# EAGLE design eCog121_DHT_Temperature (EAGLE 6.6.0)
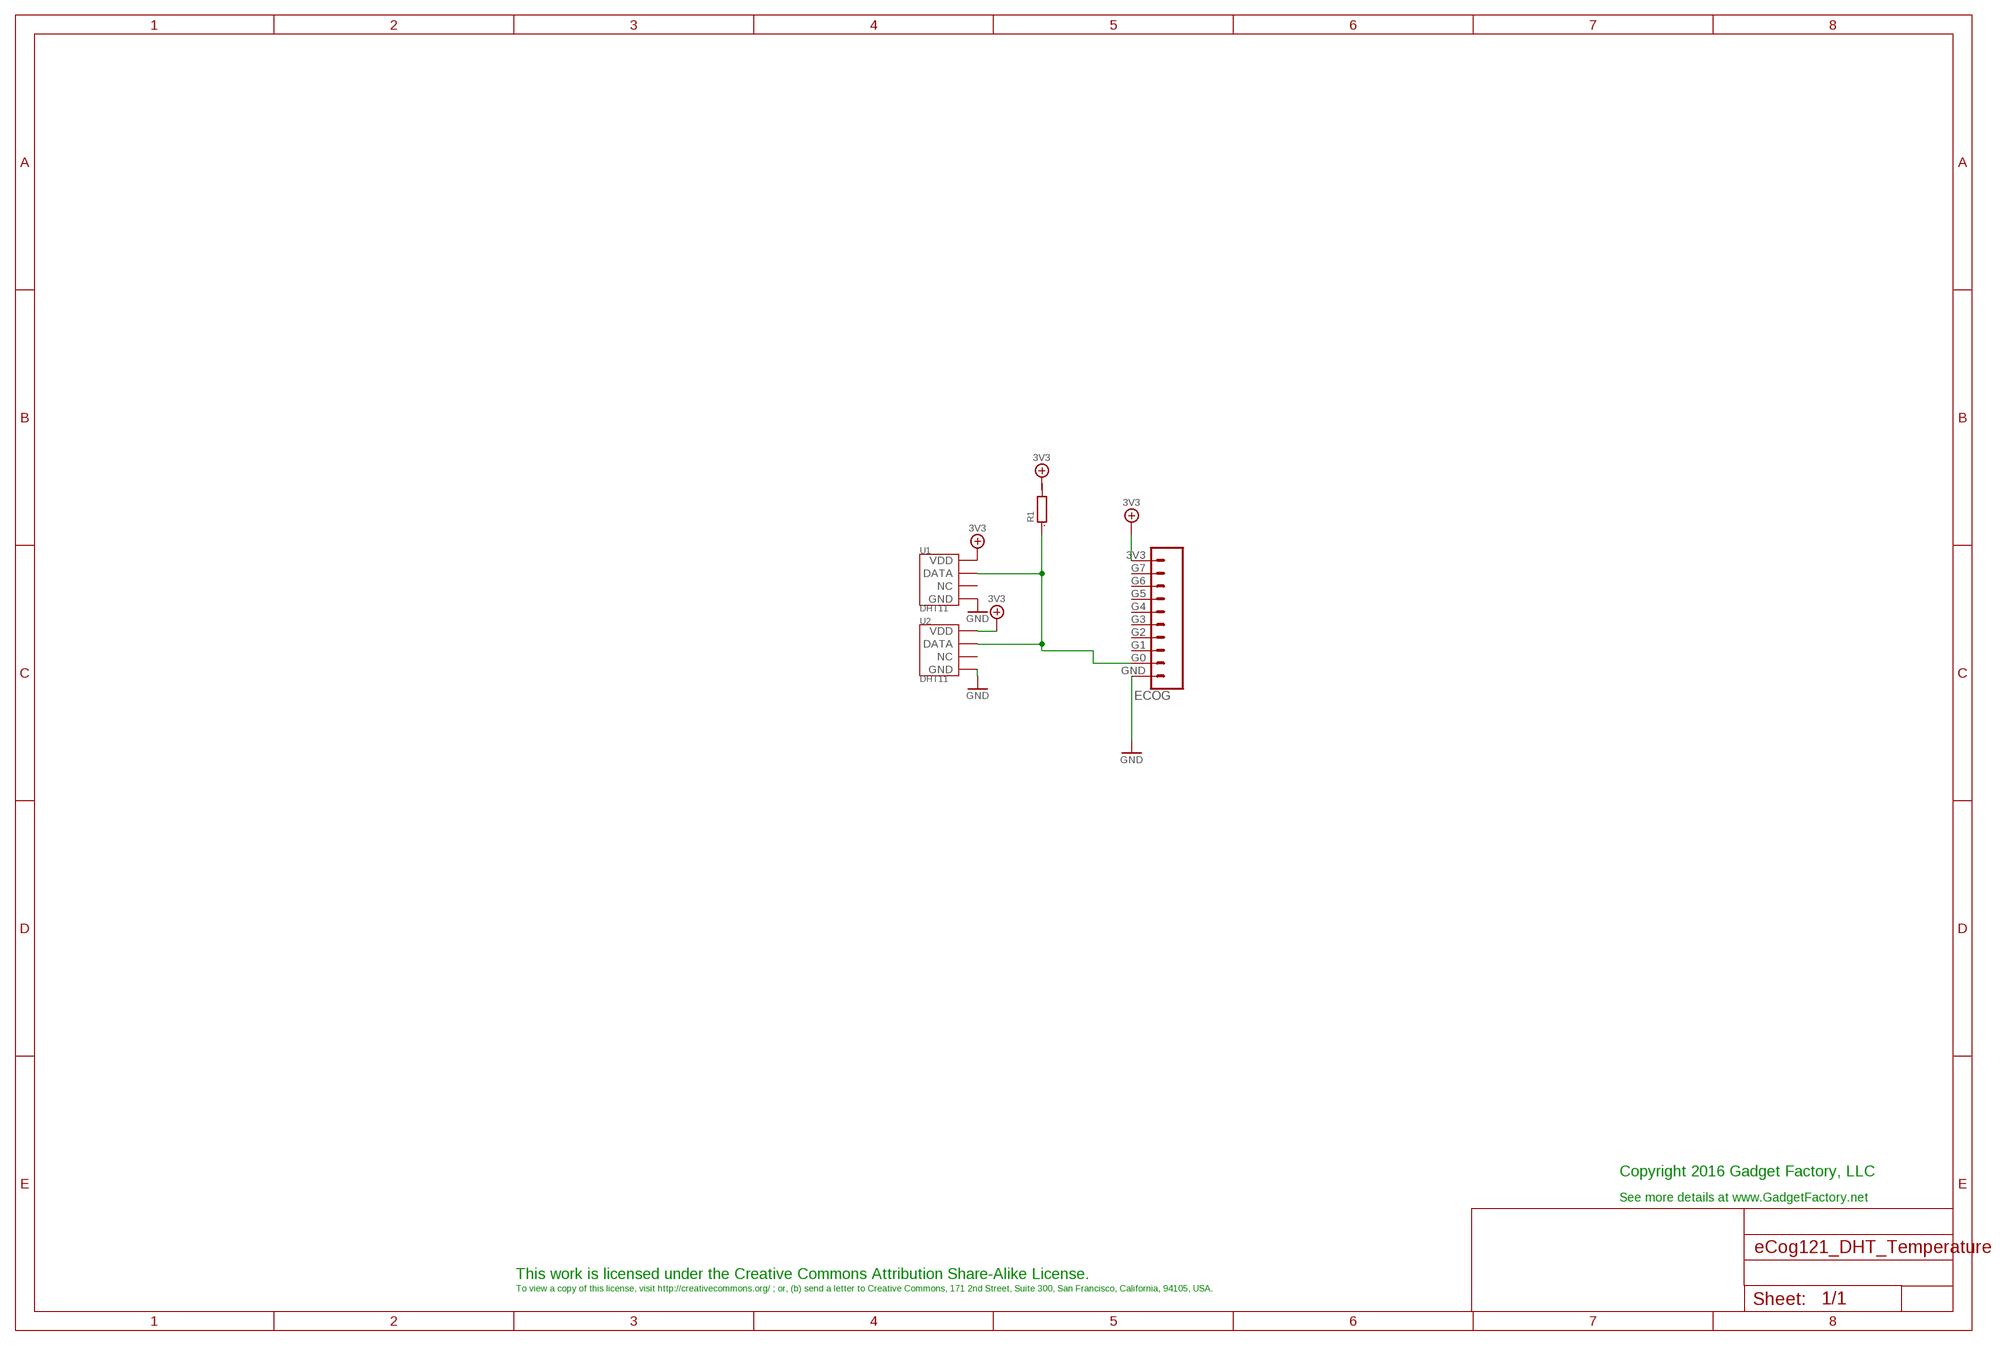
[diagram p0: schematic, sheet 1]

## Parts
ECOG  ECOG_GENERAL_ROWTHROUGHOLE  [ECOG_GENERAL_TH]
R1  R0805  [0805]
U1  DHT11  TEM-HUM-DHT11(4P-15.5X12.0MM)  [SNR4-2.54-15.5X12.0X5.5MM]
U2  DHT11  TEM-HUM-DHT11(4P-15.5X12.0MM)  [SNR4-2.54-15.5X12.0X5.5MM]

## Nets
3V3: ECOG.3V3 U1.1(VDD)
GND: ECOG.GND U1.4(GND) U2.4(GND)
N$1: ECOG.G0 R1.1 U1.2(DATA) U2.2(DATA)
VDD: U2.1(VDD) ; supply symbol labelled 3V3
Unconnected: ECOG.G1 ECOG.G2 ECOG.G3 ECOG.G4 ECOG.G5 ECOG.G6 ECOG.G7 R1.2 U1.3(NC) U2.3(NC)

## Notes on the sheet
- Copyright 2016 Gadget Factory, LLC
- See more details at www.GadgetFactory.net
- This work is licensed under the Creative Commons Attribution Share-Alike License.
- To view a copy of this license, visit http://creativecommons.org/ ; or, (b) send a letter to Creative Commons, 171 2nd Street, Suite 300, San Francisco, California, 94105, USA.

## Library data of the parts
ECOG = eCogs:ECOG_GENERAL_ROW
R1 = GadgetFactory:R: RESISTOR, European symbol
U1 U2 = Seeed-OPL-sensor:TEM-HUM-DHT11(4P-15.5X12.0MM): 314010000; MPN: DHT11

## Board
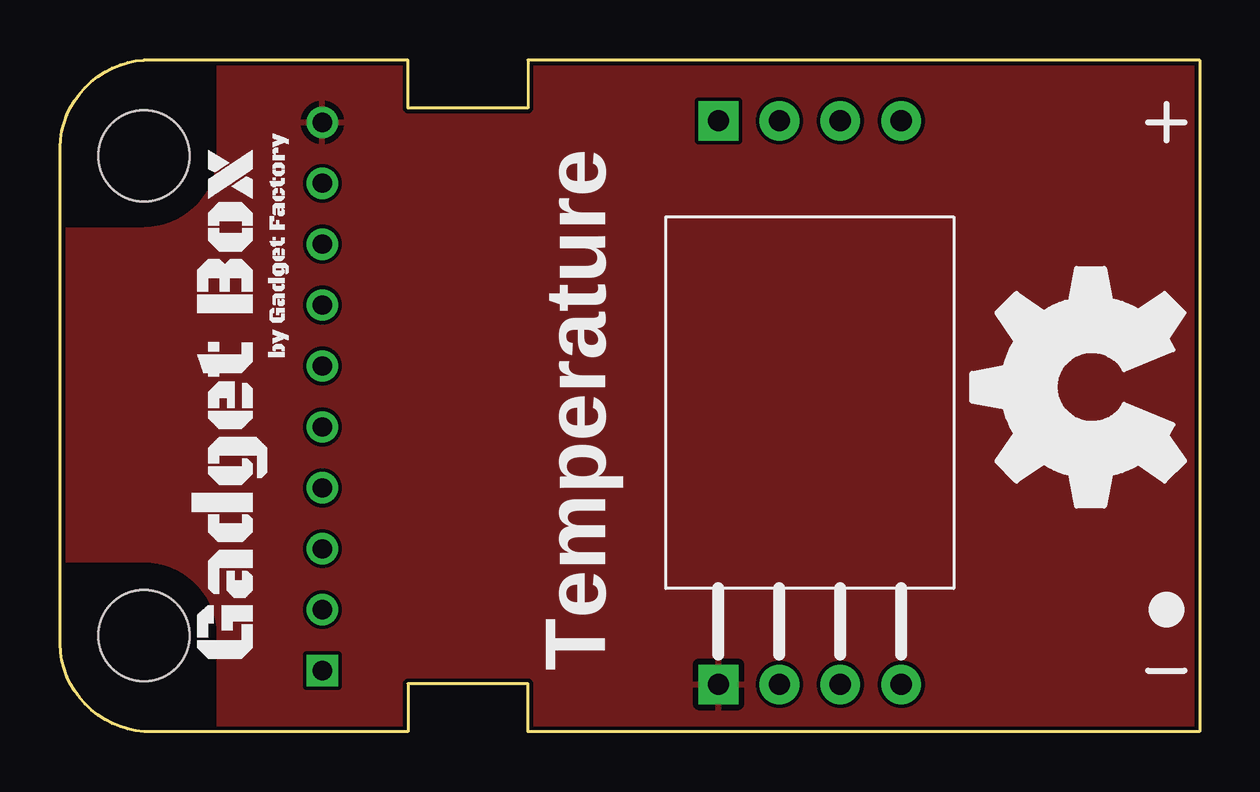
[diagram p1: board, top side]
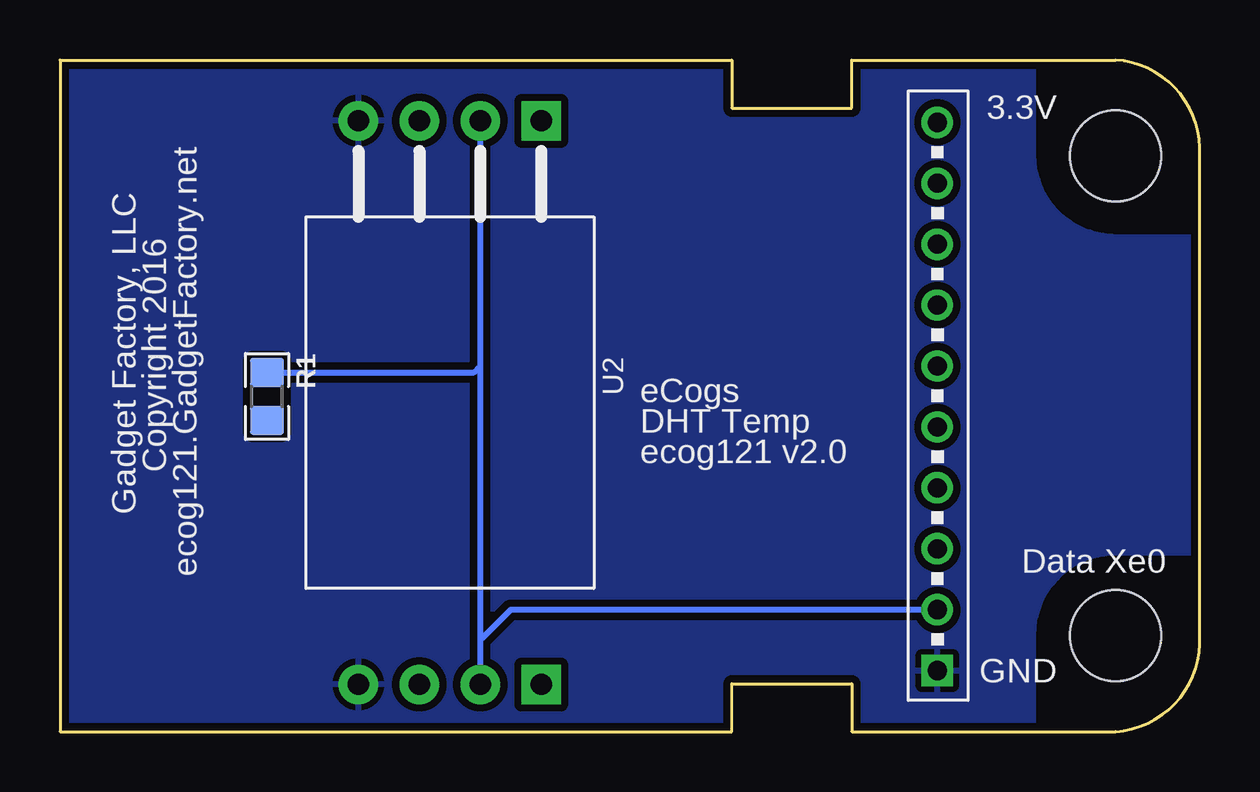
[diagram p2: board, bottom side, seen from below]

Size 47.51 x 28 mm. Coordinates in mm from the lower left corner, seen from the top.
Copper layers (1*16): Top 0.035mm / dielectric 1.5mm / Bottom 0.035mm
Design rules "hackvana *": minimum track width 6mil, minimum drill 0.3mm, track to track 6mil, track to pad 6mil, pad to pad 6mil, via to via 6mil, smd to smd 0mil, copper to edge 6mil, drill to drill 6mil, minimum pad ring 10mil, minimum via ring 6mil, stop-mask expansion 2mil, vias tented up to drill 100mil, thermal gap 10mil

### Footprints (pad centres in the part's own frame; a part is rotated, then mirrored left to right if it is on the bottom)
ECOG_GENERAL_TH = drill 0.8: 3V3 11.43,25.4; G0 11.43,5.08; G1 11.43,7.62; G2 11.43,10.16; G3 11.43,12.7; G4 11.43,15.24; G5 11.43,17.78; G6 11.43,20.32; G7 11.43,22.86 | drill 0.8 square: GND 11.43,2.54 | hole 3.8: 4,24; 4,4
0805 = smd 1.2 x 1.4: 1 -1,0; 2 1,0
SNR4-2.54-15.5X12.0X5.5MM = drill 0.889 pad 1.651 square: 1 -11.75,3.81 | drill 0.889 pad 1.651: 2 -11.75,1.27; 3 -11.75,-1.27; 4 -11.75,-3.81

### Placement (x,y rotation side)
ECOG  -0.49,0 0 top
R1  38.88,13.97 270 bottom
U1  31.26,13.72 90 top
U2  31.26,13.72 270 bottom
U$1  [GADGETBOX_SMALL]  7.13,13.72 90 top
U$2  [LEGEND_DIO]  46.12,5.08 0 top
U$10  [OSHW_FILLX350_NOTEXT]  46.88,9.4 90 top

### Tracks (layer width: path | path; a pad name or v marks a point on that pad's centre or on a via)
3V3
  pour Top: -1.49,29 48.51,29 48.51,-1 -1.49,-1
GND
  pour Bottom (isolate 0.305): -2.49,30 49.51,30 49.51,-2 -2.49,-2
N$1
  Bottom 0.254: ECOG.G0 28.72,5.08 29.99,3.81 | 29.99,3.81 U1.2 | U2.2 29.99,15.24 | 29.99,15.24 29.99,3.81 | R1.1 30.26,14.97 29.99,15.24

### Text on the board
tPlace: Temperature
bPlace: 3.3V | ecog121.GadgetFactory.net | Gadget Factory, LLC | Copyright 2016 | eCogs | DHT Temp | ecog121 v2.0 | Data Xe0 | GND